# EAGLE schematic lcd_breakout (EAGLE 9.6.2)

## Sheet 1 of 2
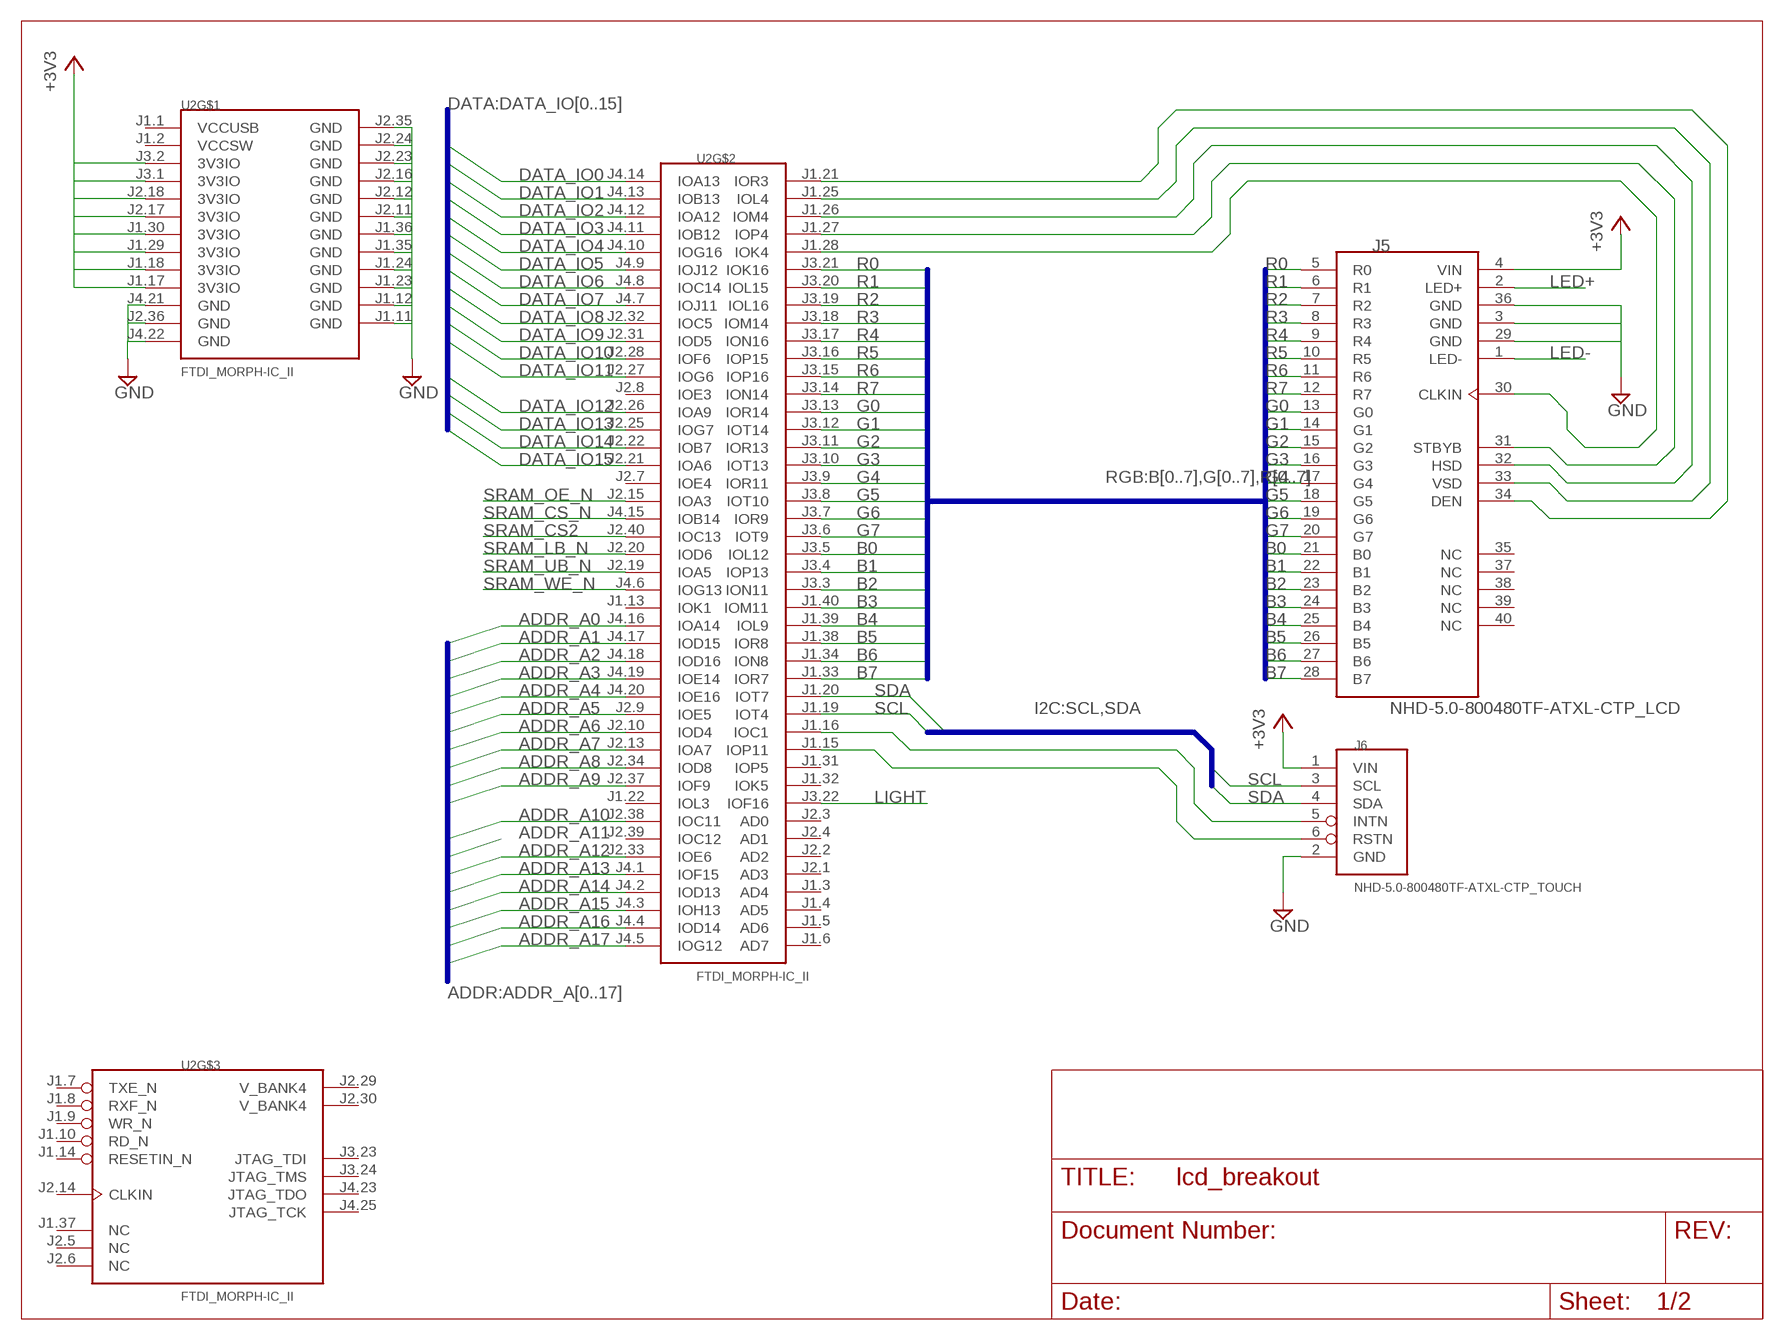
[diagram p0: schematic, sheet 1]

### Parts
J5  NHD-5.0-800480TF-ATXL-CTP_LCD  [54132-4097]
J6  NHD-5.0-800480TF-ATXL-CTP_TOUCH  [52271-0679]
U2  FTDI_MORPH-IC_II  [MORPH-IC-II]

### Nets
+3V3: J5.4(VIN) J6.1(VIN) U2.J1.17(3V3IO) U2.J1.18(3V3IO) U2.J1.29(3V3IO) U2.J1.30(3V3IO) U2.J2.17(3V3IO) U2.J2.18(3V3IO) U2.J3.1(3V3IO) U2.J3.2(3V3IO) ; also sheet 2
ADDR_A0: U2.J4.16(IOA14) ; also sheet 2
ADDR_A1: U2.J4.17(IOD15) ; also sheet 2
ADDR_A2: U2.J4.18(IOD16) ; also sheet 2
ADDR_A3: U2.J4.19(IOE14) ; also sheet 2
ADDR_A4: U2.J4.20(IOE16) ; also sheet 2
ADDR_A5: U2.J2.9(IOE5) ; also sheet 2
ADDR_A6: U2.J2.10(IOD4) ; also sheet 2
ADDR_A7: U2.J2.13(IOA7) ; also sheet 2
ADDR_A8: U2.J2.34(IOD8) ; also sheet 2
ADDR_A9: U2.J2.37(IOF9) ; also sheet 2
ADDR_A10: U2.J2.38(IOC11) ; also sheet 2
ADDR_A12: U2.J2.33(IOE6) ; also sheet 2
ADDR_A13: U2.J4.1(IOF15) ; also sheet 2
ADDR_A14: U2.J4.2(IOD13) ; also sheet 2
ADDR_A15: U2.J4.3(IOH13) ; also sheet 2
ADDR_A16: U2.J4.4(IOD14) ; also sheet 2
ADDR_A17: U2.J4.5(IOG12) ; also sheet 2
B0: J5.21(B0) U2.J3.5(IOL12)
B1: J5.22(B1) U2.J3.4(IOP13)
B2: J5.23(B2) U2.J3.3(ION11)
B3: J5.24(B3) U2.J1.40(IOM11)
B4: J5.25(B4) U2.J1.39(IOL9)
B5: J5.26(B5) U2.J1.38(IOR8)
B6: J5.27(B6) U2.J1.34(ION8)
B7: J5.28(B7) U2.J1.33(IOR7)
CLKIN: J5.30(CLKIN) U2.J1.28(IOK4)
DATA_IO0: U2.J4.14(IOA13) ; also sheet 2
DATA_IO1: U2.J4.13(IOB13) ; also sheet 2
DATA_IO2: U2.J4.12(IOA12) ; also sheet 2
DATA_IO3: U2.J4.11(IOB12) ; also sheet 2
DATA_IO4: U2.J4.10(IOG16) ; also sheet 2
DATA_IO5: U2.J4.9(IOJ12) ; also sheet 2
DATA_IO6: U2.J4.8(IOC14) ; also sheet 2
DATA_IO7: U2.J4.7(IOJ11) ; also sheet 2
DATA_IO8: U2.J2.32(IOC5) ; also sheet 2
DATA_IO9: U2.J2.31(IOD5) ; also sheet 2
DATA_IO10: U2.J2.28(IOF6) ; also sheet 2
DATA_IO11: U2.J2.27(IOG6) ; also sheet 2
DATA_IO12: U2.J2.26(IOA9) ; also sheet 2
DATA_IO13: U2.J2.25(IOG7) ; also sheet 2
DATA_IO14: U2.J2.22(IOB7) ; also sheet 2
DATA_IO15: U2.J2.21(IOA6) ; also sheet 2
DEN: J5.34(DEN) U2.J1.21(IOR3)
G0: J5.13(G0) U2.J3.13(IOR14)
G1: J5.14(G1) U2.J3.12(IOT14)
G2: J5.15(G2) U2.J3.11(IOR13)
G3: J5.16(G3) U2.J3.10(IOT13)
G4: J5.17(G4) U2.J3.9(IOR11)
G5: J5.18(G5) U2.J3.8(IOT10)
G6: J5.19(G6) U2.J3.7(IOR9)
G7: J5.20(G7) U2.J3.6(IOT9)
GND: J5.3(GND) J5.29(GND) J5.36(GND) J6.2(GND) U2.J1.11(GND) U2.J1.12(GND) U2.J1.23(GND) U2.J1.24(GND) U2.J1.35(GND) U2.J1.36(GND) U2.J2.11(GND) U2.J2.12(GND) U2.J2.16(GND) U2.J2.23(GND) U2.J2.24(GND) U2.J2.35(GND) U2.J2.36(GND) U2.J4.21(GND) U2.J4.22(GND) ; also sheet 2
HSD: J5.32(HSD) U2.J1.26(IOM4)
INTN: J6.5(INTN) U2.J1.16(IOC1)
LED+: J5.2(LED+) ; also sheet 2
LED-: J5.1(LED-) ; also sheet 2
LIGHT: U2.J3.22(IOF16) ; also sheet 2
R0: J5.5(R0) U2.J3.21(IOK16)
R1: J5.6(R1) U2.J3.20(IOL15)
R2: J5.7(R2) U2.J3.19(IOL16)
R3: J5.8(R3) U2.J3.18(IOM14)
R4: J5.9(R4) U2.J3.17(ION16)
R5: J5.10(R5) U2.J3.16(IOP15)
R6: J5.11(R6) U2.J3.15(IOP16)
R7: J5.12(R7) U2.J3.14(ION14)
RSTN: J6.6(RSTN) U2.J1.15(IOP11)
SCL: J6.3(SCL) U2.J1.19(IOT4)
SDA: J6.4(SDA) U2.J1.20(IOT7)
SRAM_CS2: U2.J2.40(IOC13) ; also sheet 2
SRAM_CS_N: U2.J4.15(IOB14) ; also sheet 2
SRAM_LB_N: U2.J2.20(IOD6) ; also sheet 2
SRAM_OE_N: U2.J2.15(IOA3) ; also sheet 2
SRAM_UB_N: U2.J2.19(IOA5) ; also sheet 2
SRAM_WE_N: U2.J4.6(IOG13) ; also sheet 2
STBYB: J5.31(STBYB) U2.J1.27(IOP4)
VSD: J5.33(VSD) U2.J1.25(IOL4)
Unconnected: J5.35(NC) J5.37(NC) J5.38(NC) J5.39(NC) J5.40(NC) U2.J1.3(AD4) U2.J1.4(AD5) U2.J1.5(AD6) U2.J1.6(AD7) U2.J1.7(TXE_N) U2.J1.8(RXF_N) U2.J1.9(WR_N) U2.J1.10(RD_N) U2.J1.13(IOK1) U2.J1.14(RESETIN_N) U2.J1.22(IOL3) U2.J1.31(IOP5) U2.J1.32(IOK5) U2.J1.37(NC) U2.J2.1(AD3) U2.J2.2(AD2) U2.J2.3(AD0) U2.J2.4(AD1) U2.J2.5(NC) U2.J2.6(NC) U2.J2.7(IOE4) U2.J2.8(IOE3) U2.J2.14(CLKIN) U2.J2.29(V_BANK4) U2.J2.30(V_BANK4) U2.J2.39(IOC12) U2.J3.23(JTAG_TDI) U2.J3.24(JTAG_TMS) U2.J4.23(JTAG_TDO) U2.J4.25(JTAG_TCK)

### Buses
RGB:B[0..7],G[0..7],R[0..7]
I2C:SCL,SDA
ADDR:ADDR_A[0..17]
DATA:DATA_IO[0..15]

## Sheet 2 of 2
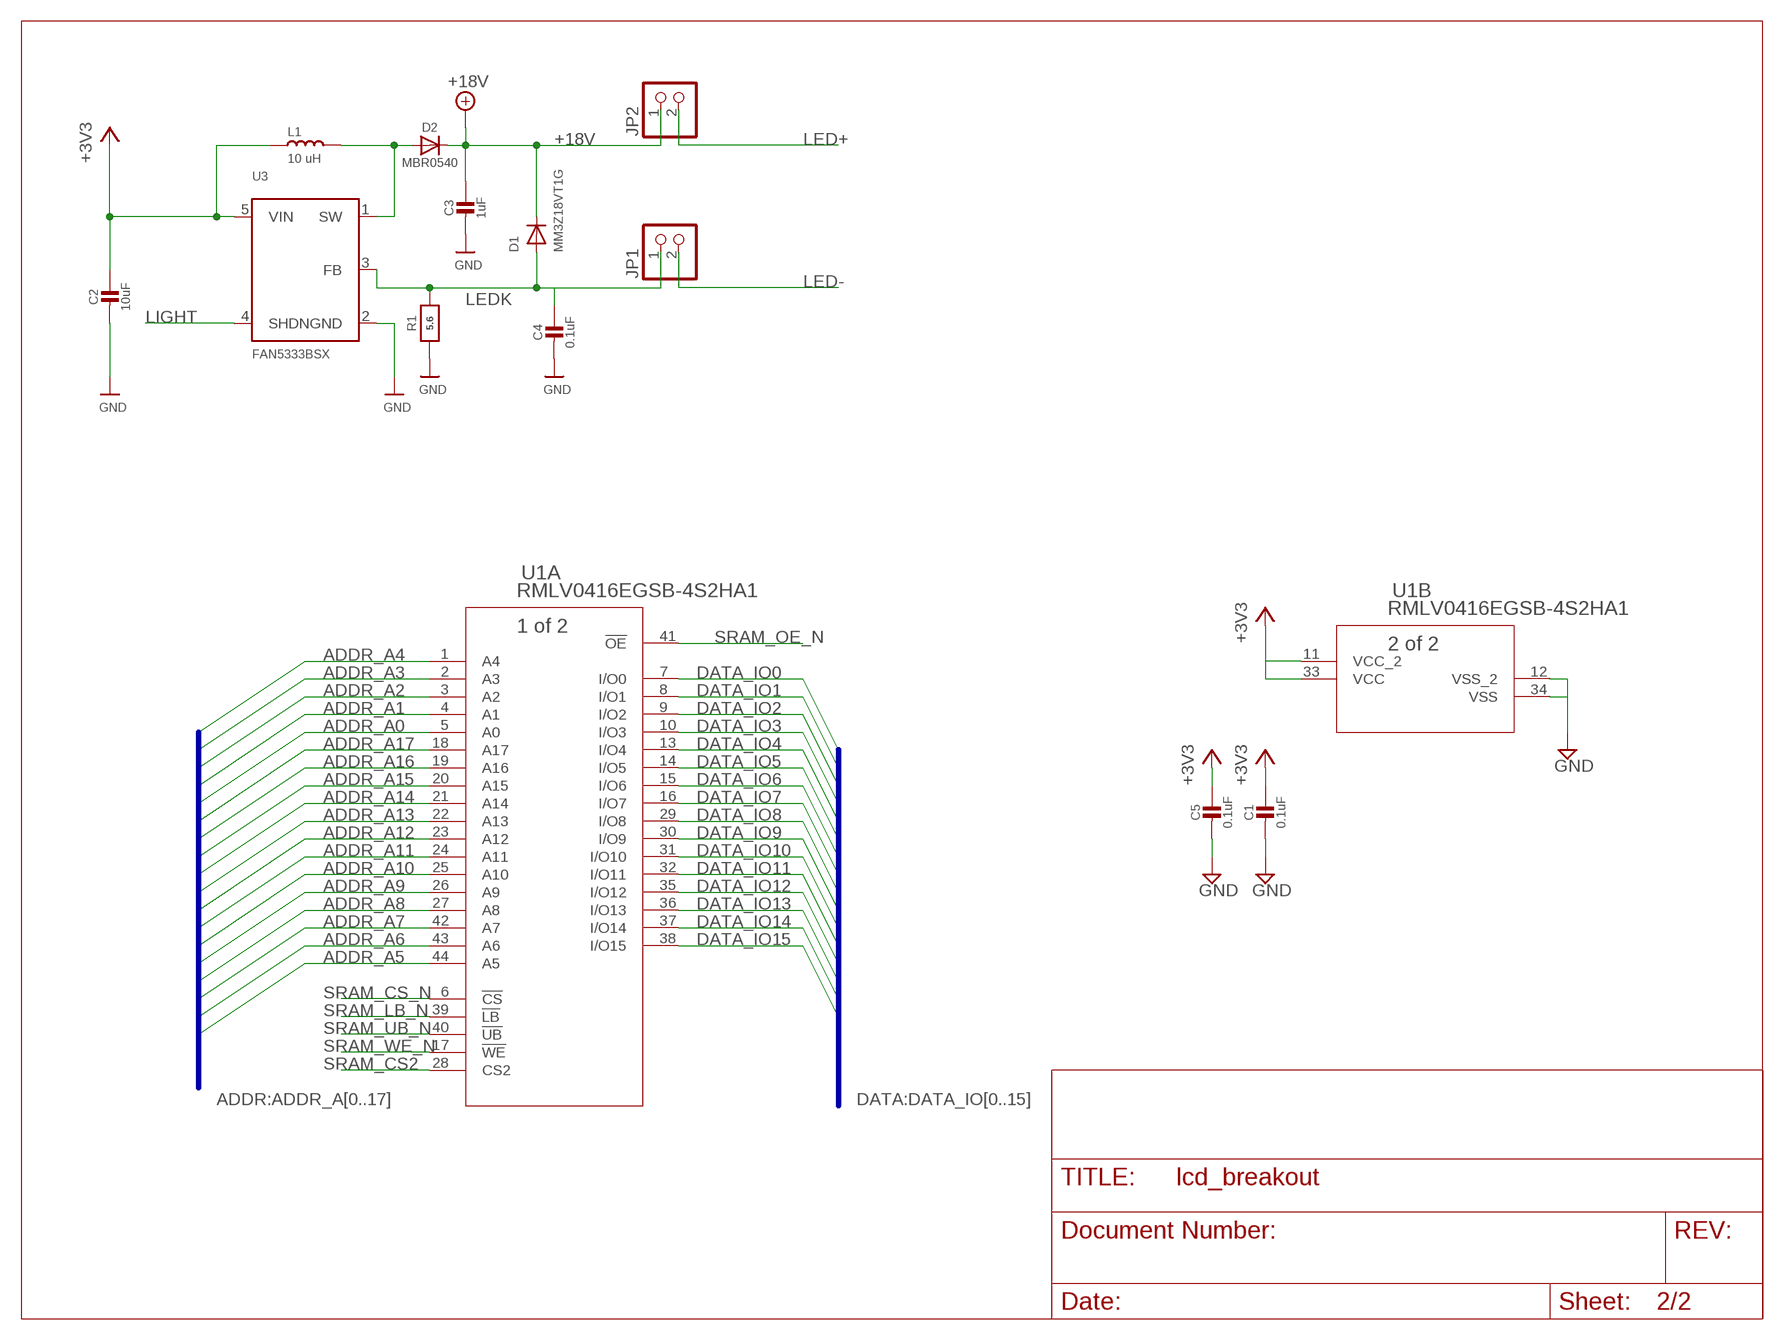
[diagram p1: schematic, sheet 2]

### Parts
C1  0.1uF  CAP_CERAMIC_0805MP  [_0805MP]
C2  10uF  CAP_CERAMIC_0805MP  [_0805MP]
C3  1uF  CAP_CERAMIC0805-NOOUTLINE  [0805-NO]
C4  0.1uF  CAP_CERAMIC0805-NOOUTLINE  [0805-NO]
C5  0.1uF  CAP_CERAMIC_0805MP  [_0805MP]
D1  MM3Z18VT1G  DIODE-SOD323  [SOD-323]
D2  MBR0540  DIODESOD-123  [SOD-123]
JP1  PINHD-1X2  [1X02]
JP2  PINHD-1X2  [1X02]
L1  10 uH  744314101  [IND_744314101_WRE]
R1  5.6  RESISTOR_0805MP  [_0805MP]
U1  RMLV0416EGSB-4S2HA1  [PTSB0044GG-A_REN]
U3  FAN5333BSX  FAN5331  [SOT23-5@1]

### Nets
+3V3: C1.1 C2.1 C5.1 L1.2 U1.11(B:VCC_2) U1.33(B:VCC) U3.5(VIN) ; also sheet 1
+18V: C3.1 D1.1(C) D2.C JP2.1
ADDR_A0: U1.5(A:A0) ; also sheet 1
ADDR_A1: U1.4(A:A1) ; also sheet 1
ADDR_A2: U1.3(A:A2) ; also sheet 1
ADDR_A3: U1.2(A:A3) ; also sheet 1
ADDR_A4: U1.1(A:A4) ; also sheet 1
ADDR_A5: U1.44(A:A5) ; also sheet 1
ADDR_A6: U1.43(A:A6) ; also sheet 1
ADDR_A7: U1.42(A:A7) ; also sheet 1
ADDR_A8: U1.27(A:A8) ; also sheet 1
ADDR_A9: U1.26(A:A9) ; also sheet 1
ADDR_A10: U1.25(A:A10) ; also sheet 1
ADDR_A11: U1.24(A:A11) ; also sheet 1
ADDR_A12: U1.23(A:A12) ; also sheet 1
ADDR_A13: U1.22(A:A13) ; also sheet 1
ADDR_A14: U1.21(A:A14) ; also sheet 1
ADDR_A15: U1.20(A:A15) ; also sheet 1
ADDR_A16: U1.19(A:A16) ; also sheet 1
ADDR_A17: U1.18(A:A17) ; also sheet 1
DATA_IO0: U1.7(A:I/O0) ; also sheet 1
DATA_IO1: U1.8(A:I/O1) ; also sheet 1
DATA_IO2: U1.9(A:I/O2) ; also sheet 1
DATA_IO3: U1.10(A:I/O3) ; also sheet 1
DATA_IO4: U1.13(A:I/O4) ; also sheet 1
DATA_IO5: U1.14(A:I/O5) ; also sheet 1
DATA_IO6: U1.15(A:I/O6) ; also sheet 1
DATA_IO7: U1.16(A:I/O7) ; also sheet 1
DATA_IO8: U1.29(A:I/O8) ; also sheet 1
DATA_IO9: U1.30(A:I/O9) ; also sheet 1
DATA_IO10: U1.31(A:I/O10) ; also sheet 1
DATA_IO11: U1.32(A:I/O11) ; also sheet 1
DATA_IO12: U1.35(A:I/O12) ; also sheet 1
DATA_IO13: U1.36(A:I/O13) ; also sheet 1
DATA_IO14: U1.37(A:I/O14) ; also sheet 1
DATA_IO15: U1.38(A:I/O15) ; also sheet 1
GND: C1.2 C2.2 C3.2 C4.2 C5.2 R1.1 U1.12(B:VSS_2) U1.34(B:VSS) U3.2(GND) ; also sheet 1
LED+: JP2.2 ; also sheet 1
LED-: JP1.2 ; also sheet 1
LEDK: C4.1 D1.2(A) JP1.1 R1.2 U3.3(FB)
LIGHT: U3.4(SHDN) ; also sheet 1
N$8: D2.A L1.1 U3.1(SW)
SRAM_CS2: U1.28(A:CS2) ; also sheet 1
SRAM_CS_N: U1.6(A:!CS) ; also sheet 1
SRAM_LB_N: U1.39(A:!LB) ; also sheet 1
SRAM_OE_N: U1.41(A:!OE) ; also sheet 1
SRAM_UB_N: U1.40(A:!UB) ; also sheet 1
SRAM_WE_N: U1.17(A:!WE) ; also sheet 1

### Buses
ADDR:ADDR_A[0..17]
DATA:DATA_IO[0..15]

## Power pins joined to a net without a drawn wire
VCCSW: U2.J1.2(VCCSW)
VCCUSB: U2.J1.1(VCCUSB)

## Library data of the parts
C1 C4 C5 = microbuilder:CAP_CERAMIC: Ceramic Capacitors For new designs, use the packages preceded by an '_' character since they are more reliable: The following footprints should be used on most boards: _0402 - Standard footprint for regular board layouts _0603 - Standard footprint for regular board layouts _0805 - Standard footprint for regular board layouts _1206 - Standard footprint for regular board layouts For extremely tight-pitch boards where space is at a premium, the following 'micro-pitch' footprints can be used (smaller pads, no silkscreen outline, etc.): _0402MP - Micro-pitch footprint for very dense/compact boards _0603MP - Micro-pitch footprint for very dense/compact boards _0805MP - Micro-pitch footprint for very dense/compact boards _1206MP - Micro-pitch footprint for very dense/compact boards; DPN: 478-12799-1-ND; MPN: 0805ZD104KAT2A
C2 = microbuilder:CAP_CERAMIC: Ceramic Capacitors For new designs, use the packages preceded by an '_' character since they are more reliable: The following footprints should be used on most boards: _0402 - Standard footprint for regular board layouts _0603 - Standard footprint for regular board layouts _0805 - Standard footprint for regular board layouts _1206 - Standard footprint for regular board layouts For extremely tight-pitch boards where space is at a premium, the following 'micro-pitch' footprints can be used (smaller pads, no silkscreen outline, etc.): _0402MP - Micro-pitch footprint for very dense/compact boards _0603MP - Micro-pitch footprint for very dense/compact boards _0805MP - Micro-pitch footprint for very dense/compact boards _1206MP - Micro-pitch footprint for very dense/compact boards; DPN: 1276-6456-1-ND; MPN: CL21A106KPFNNNG
C3 = microbuilder:CAP_CERAMIC: Ceramic Capacitors For new designs, use the packages preceded by an '_' character since they are more reliable: The following footprints should be used on most boards: _0402 - Standard footprint for regular board layouts _0603 - Standard footprint for regular board layouts _0805 - Standard footprint for regular board layouts _1206 - Standard footprint for regular board layouts For extremely tight-pitch boards where space is at a premium, the following 'micro-pitch' footprints can be used (smaller pads, no silkscreen outline, etc.): _0402MP - Micro-pitch footprint for very dense/compact boards _0603MP - Micro-pitch footprint for very dense/compact boards _0805MP - Micro-pitch footprint for very dense/compact boards _1206MP - Micro-pitch footprint for very dense/compact boards; DPN: 1276-2395-1-ND; MPN: CL21A105KACLNNC
D1 = ik:DIODE-SOD323; DPN: MM3Z18VT1GOSCT-ND; MPN: MM3Z18VT1G
D2 = microbuilder:DIODE: Diode SMA Model Volts Amps Type Vf Ir Digikey # Notes SSA34-E3 40V 3A Schottky 480mV @ 3A 200uA @ 40V SSA34-E3/61TGITR-ND CDBA120-G 20V 1A Schottky 500mV @ 1A 500uA @ 20V 641-1014-6-ND REEL MBRA210 10V 2A Schottky 350mV @ 2A 700uA @ 10V MBRA210LT3 SOD-123 Model Volts Amps Type Vf Ir Order # Notes BAT54T1G 30V 200mA Schottky 800mV @ 200mA 2uA @ 25V BAT54T1GOSTR-ND B0530W 30V 500mA Schottky 430mV @ 500mA 130uA @ 30V B0530W-FDICT-ND REEL MBR120 20V 1A Schottky 340mV @ 1A MBR120VLSFT1GOSCT-ND SOD-323 Model Volts Amps Type Vf Ir Order # Notes PMEG2005EJ 20V 500mA Schottky 355mV @ 500mA 568-4110-1-ND ZLLS410 10V 570mA Schottky 380mV @ 570mA ZLLS410CT-ND 1N4148WS 75V 150mA Silicon/Simple 1V 1N4148WSFSCT-ND REEL SOD-523 Model Volts Amps Type Vf Ir Order # Notes BAT54XV2 30V 200mA Schottky 0.8V @ 100mA BAT54XV2CT-ND TB751S 30V 30mA Schottky RB751S-40TE61CT-ND SOT23-R/W (R = Solder Paste/Reflow Ovens, W = Hand-Soldering) Model Volts Amps Type Vf Ir Order # Notes BAT54FILM 40V 300mA Schottky 497-7162-1-ND POWERDI-5 Model Volts Amps Type Vf Ir Order # Notes PDS560 60V 5A Schottky 670mV @ 5A 150uA @ 60V PDS560DICT-ND; DPN: MBR0540CT-ND; MPN: MBR0540
J5 = ik:NHD-5.0-800480TF-ATXL-CTP_LCD; DPN: WM3431CT-ND; MPN: 54104-4031
J6 = ik:NHD-5.0-800480TF-ATXL-CTP_TOUCH; DPN: WM7955CT-ND; MPN: 52271-0679
JP1 JP2 = pinhead:PINHD-1X2: PIN HEADER; DPN: A121364-ND; MPN: 4-103328-1
L1 = ultralibrarian:744314101; BUILT_BY: EMA_Justin; COPYRIGHT: Copyright (C) 2016 Accelerated Designs. All rights reserved; DPN: 732-2180-1-ND; MANUFACTURER_PART_NUMBER: 744314101; MPN: 744314101; SOURCELIBRARY: Wurth_2018-12-15; VENDOR: Wurth Electronics
R1 = microbuilder:RESISTOR: Resistors For new designs, use the packages preceded by an '_' character since they are more reliable: The following footprints should be used on most boards: _0402 - Standard footprint for regular board layouts _0603 - Standard footprint for regular board layouts _0805 - Standard footprint for regular board layouts _1206 - Standard footprint for regular board layouts For extremely tight-pitch boards where space is at a premium, the following 'micro-pitch' footprints can be used (smaller pads, no silkscreen outline, etc.): _0402MP - Micro-pitch footprint for very dense/compact boards _0603MP - Micro-pitch footprint for very dense/compact boards _0805MP - Micro-pitch footprint for very dense/compact boards _1206MP - Micro-pitch footprint for very dense/compact boards; DPN: 311-5.60CRCT-ND; MPN: RC0805FR-075R6L
U1 = ultralibrarian:RMLV0416EGSB-4S2HA1; BUILT_BY: EMA_Jessica; COPYRIGHT: Copyright (C) 2018 Accelerated Designs. All rights reserved; DPN: RMLV0416EGSB-4S2; MANUFACTURER_PART_NUMBER: RMLV0416EGSB-4S2#HA1; MPN: RMLV0416EGSB-4S2#HA1; SOURCELIBRARY: Renesas_2019-10-17_1; VENDOR: Renesas Electronics
U2 = ik:FTDI_MORPH-IC_II; DPN: 2x S5729-ND, 2x S5721-ND; MPN: 2x NPPC202KFMS-RC, 2x NPPC122KFMS-RC
U3 = microbuilder:FAN5331: FAN5331 - LED/OLED 20V Boost Converter Digikey: FAN5331SXCT-ND; DPN: FAN5333BSXCT-ND; MPN: FAN5333BSX